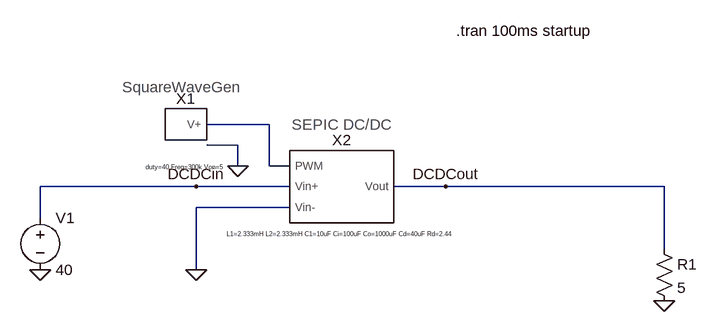
[diagram p0: schematic sepictest.asc]
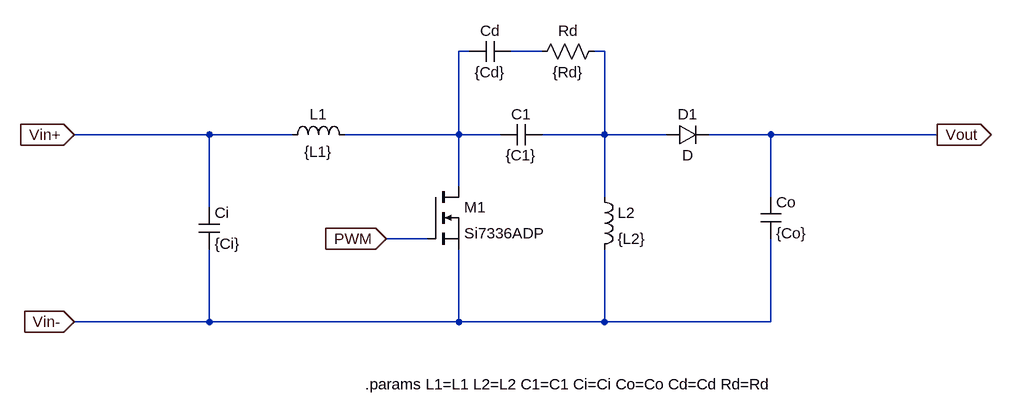
[diagram p1: sub-circuit sepicr2.asc]
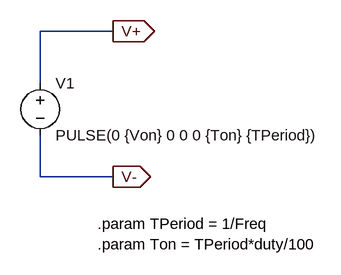
[diagram p2: sub-circuit swgen.asc]
sepictest.asc, the LTspice schematic file:
Version 4
SHEET 1 2376 820
WIRE 896 288 800 288
WIRE 848 320 800 320
WIRE 848 352 848 320
WIRE 896 352 896 288
WIRE 928 352 896 352
WIRE 784 384 544 384
WIRE 928 384 784 384
WIRE 1168 384 1088 384
WIRE 1504 384 1168 384
WIRE 928 416 784 416
WIRE 544 432 544 384
WIRE 1504 480 1504 384
WIRE 784 512 784 416
FLAG 784 512 0
FLAG 848 352 0
FLAG 784 384 DCDCin
FLAG 1168 384 DCDCout
FLAG 544 512 0
FLAG 1504 560 0
SYMBOL sepicR2 1008 384 R0
SYMATTR InstName X2
SYMATTR SpiceLine L1=2.333mH L2=2.333mH C1=10uF Ci=100uF Co=1000uF Cd=40uF Rd=2.44
SYMBOL swgen 768 288 R0
WINDOW 39 -2 66 Center 0
SYMATTR SpiceLine duty=40 Freq=300k Von=5
SYMATTR InstName X1
SYMBOL voltage 544 416 R0
WINDOW 123 0 0 Left 0
WINDOW 39 0 0 Left 0
SYMATTR InstName V1
SYMATTR Value 40
SYMBOL res 1488 464 R0
SYMATTR InstName R1
SYMATTR Value 5
TEXT 1184 144 Left 2 !.tran 100ms startup

sepicr2.asc, the sub-circuit schematic file:
Version 4
SHEET 1 1508 680
WIRE 240 -64 224 -64
WIRE 352 -64 304 -64
WIRE 448 -64 432 -64
WIRE -160 64 -368 64
WIRE -32 64 -160 64
WIRE 224 64 224 -64
WIRE 224 64 48 64
WIRE 288 64 224 64
WIRE 448 64 448 -64
WIRE 448 64 352 64
WIRE 544 64 448 64
WIRE 704 64 608 64
WIRE 960 64 704 64
WIRE 224 144 224 64
WIRE 448 160 448 64
WIRE 704 160 704 64
WIRE -160 176 -160 64
WIRE 176 224 112 224
WIRE -160 352 -160 240
WIRE -160 352 -368 352
WIRE 224 352 224 240
WIRE 224 352 -160 352
WIRE 448 352 448 240
WIRE 448 352 224 352
WIRE 704 352 704 224
WIRE 704 352 448 352
FLAG -368 64 Vin+
IOPIN -368 64 In
FLAG 112 224 PWM
IOPIN 112 224 In
FLAG 960 64 Vout
IOPIN 960 64 Out
FLAG -368 352 Vin-
IOPIN -368 352 In
SYMBOL cap -176 176 R0
SYMATTR InstName Ci
SYMATTR Value {Ci}
SYMBOL nmos 176 144 R0
SYMATTR InstName M1
SYMATTR Value Si7336ADP
SYMBOL ind 432 144 R0
SYMATTR InstName L2
SYMATTR Value {L2}
SYMBOL cap 688 160 R0
SYMATTR InstName Co
SYMATTR Value {Co}
SYMBOL diode 544 80 R270
WINDOW 0 32 32 VTop 2
WINDOW 3 0 32 VBottom 2
SYMATTR InstName D1
SYMBOL ind -48 80 R270
WINDOW 0 32 56 VTop 2
WINDOW 3 5 56 VBottom 2
SYMATTR InstName L1
SYMATTR Value {L1}
SYMBOL cap 352 48 R90
WINDOW 0 0 32 VBottom 2
WINDOW 3 32 32 VTop 2
SYMATTR InstName C1
SYMATTR Value {C1}
SYMBOL cap 304 -80 R90
WINDOW 0 0 32 VBottom 2
WINDOW 3 32 32 VTop 2
SYMATTR InstName Cd
SYMATTR Value {Cd}
SYMBOL res 448 -80 R90
WINDOW 0 0 56 VBottom 2
WINDOW 3 32 56 VTop 2
SYMATTR InstName Rd
SYMATTR Value {Rd}
TEXT 80 448 Left 2 !.params L1=L1 L2=L2 C1=C1 Ci=Ci Co=Co Cd=Cd Rd=Rd

swgen.asc, the sub-circuit schematic file:
Version 4
SHEET 1 880 680
WIRE 208 16 96 16
WIRE 96 96 96 16
WIRE 96 240 96 176
WIRE 208 240 96 240
FLAG 208 16 V+
IOPIN 208 16 Out
FLAG 208 240 V-
IOPIN 208 240 Out
SYMBOL voltage 96 80 R0
WINDOW 123 0 0 Left 0
WINDOW 39 0 0 Left 0
SYMATTR InstName V1
SYMATTR Value PULSE(0 {Von} 0 0 0 {Ton} {TPeriod})
TEXT 184 312 Left 2 !.param TPeriod = 1/Freq
TEXT 184 344 Left 2 !.param Ton = TPeriod*duty/100

The netlist it stands for:
* sepictest.asc
XX2 N001 DCDCin 0 DCDCout sepicr2 params: L1=2.333mH L2=2.333mH C1=10uF Ci=100uF Co=1000uF Cd=40uF Rd=2.44
XX1 N001 swgen params: duty=40 Freq=300k Von=5
V1 DCDCin 0 40
R1 DCDCout 0 5

* block symbol definitions
.subckt sepicr2 PWM Vin+ Vin- Vout
Ci Vin+ Vin- {Ci}
M1 N001 PWM Vin- Vin- Si7336ADP
L2 N003 Vin- {L2}
Co Vout Vin- {Co}
D1 N003 Vout D
L1 Vin+ N001 {L1}
C1 N003 N001 {C1}
Cd N002 N001 {Cd}
Rd N003 N002 {Rd}
.params L1=L1 L2=L2 C1=C1 Ci=Ci Co=Co Cd=Cd Rd=Rd
.ends sepicr2

.subckt swgen V+
V1 V+ V- PULSE(0 {Von} 0 0 0 {Ton} {TPeriod})
.param TPeriod = 1/Freq
.param Ton = TPeriod*duty/100
.ends swgen

.model D D
.lib standard.dio
.model NMOS NMOS
.model PMOS PMOS
.lib standard.mos
.tran 100ms startup
.backanno
.end